# EAGLE design Temporary Solution v2 (EAGLE 9.6.2)
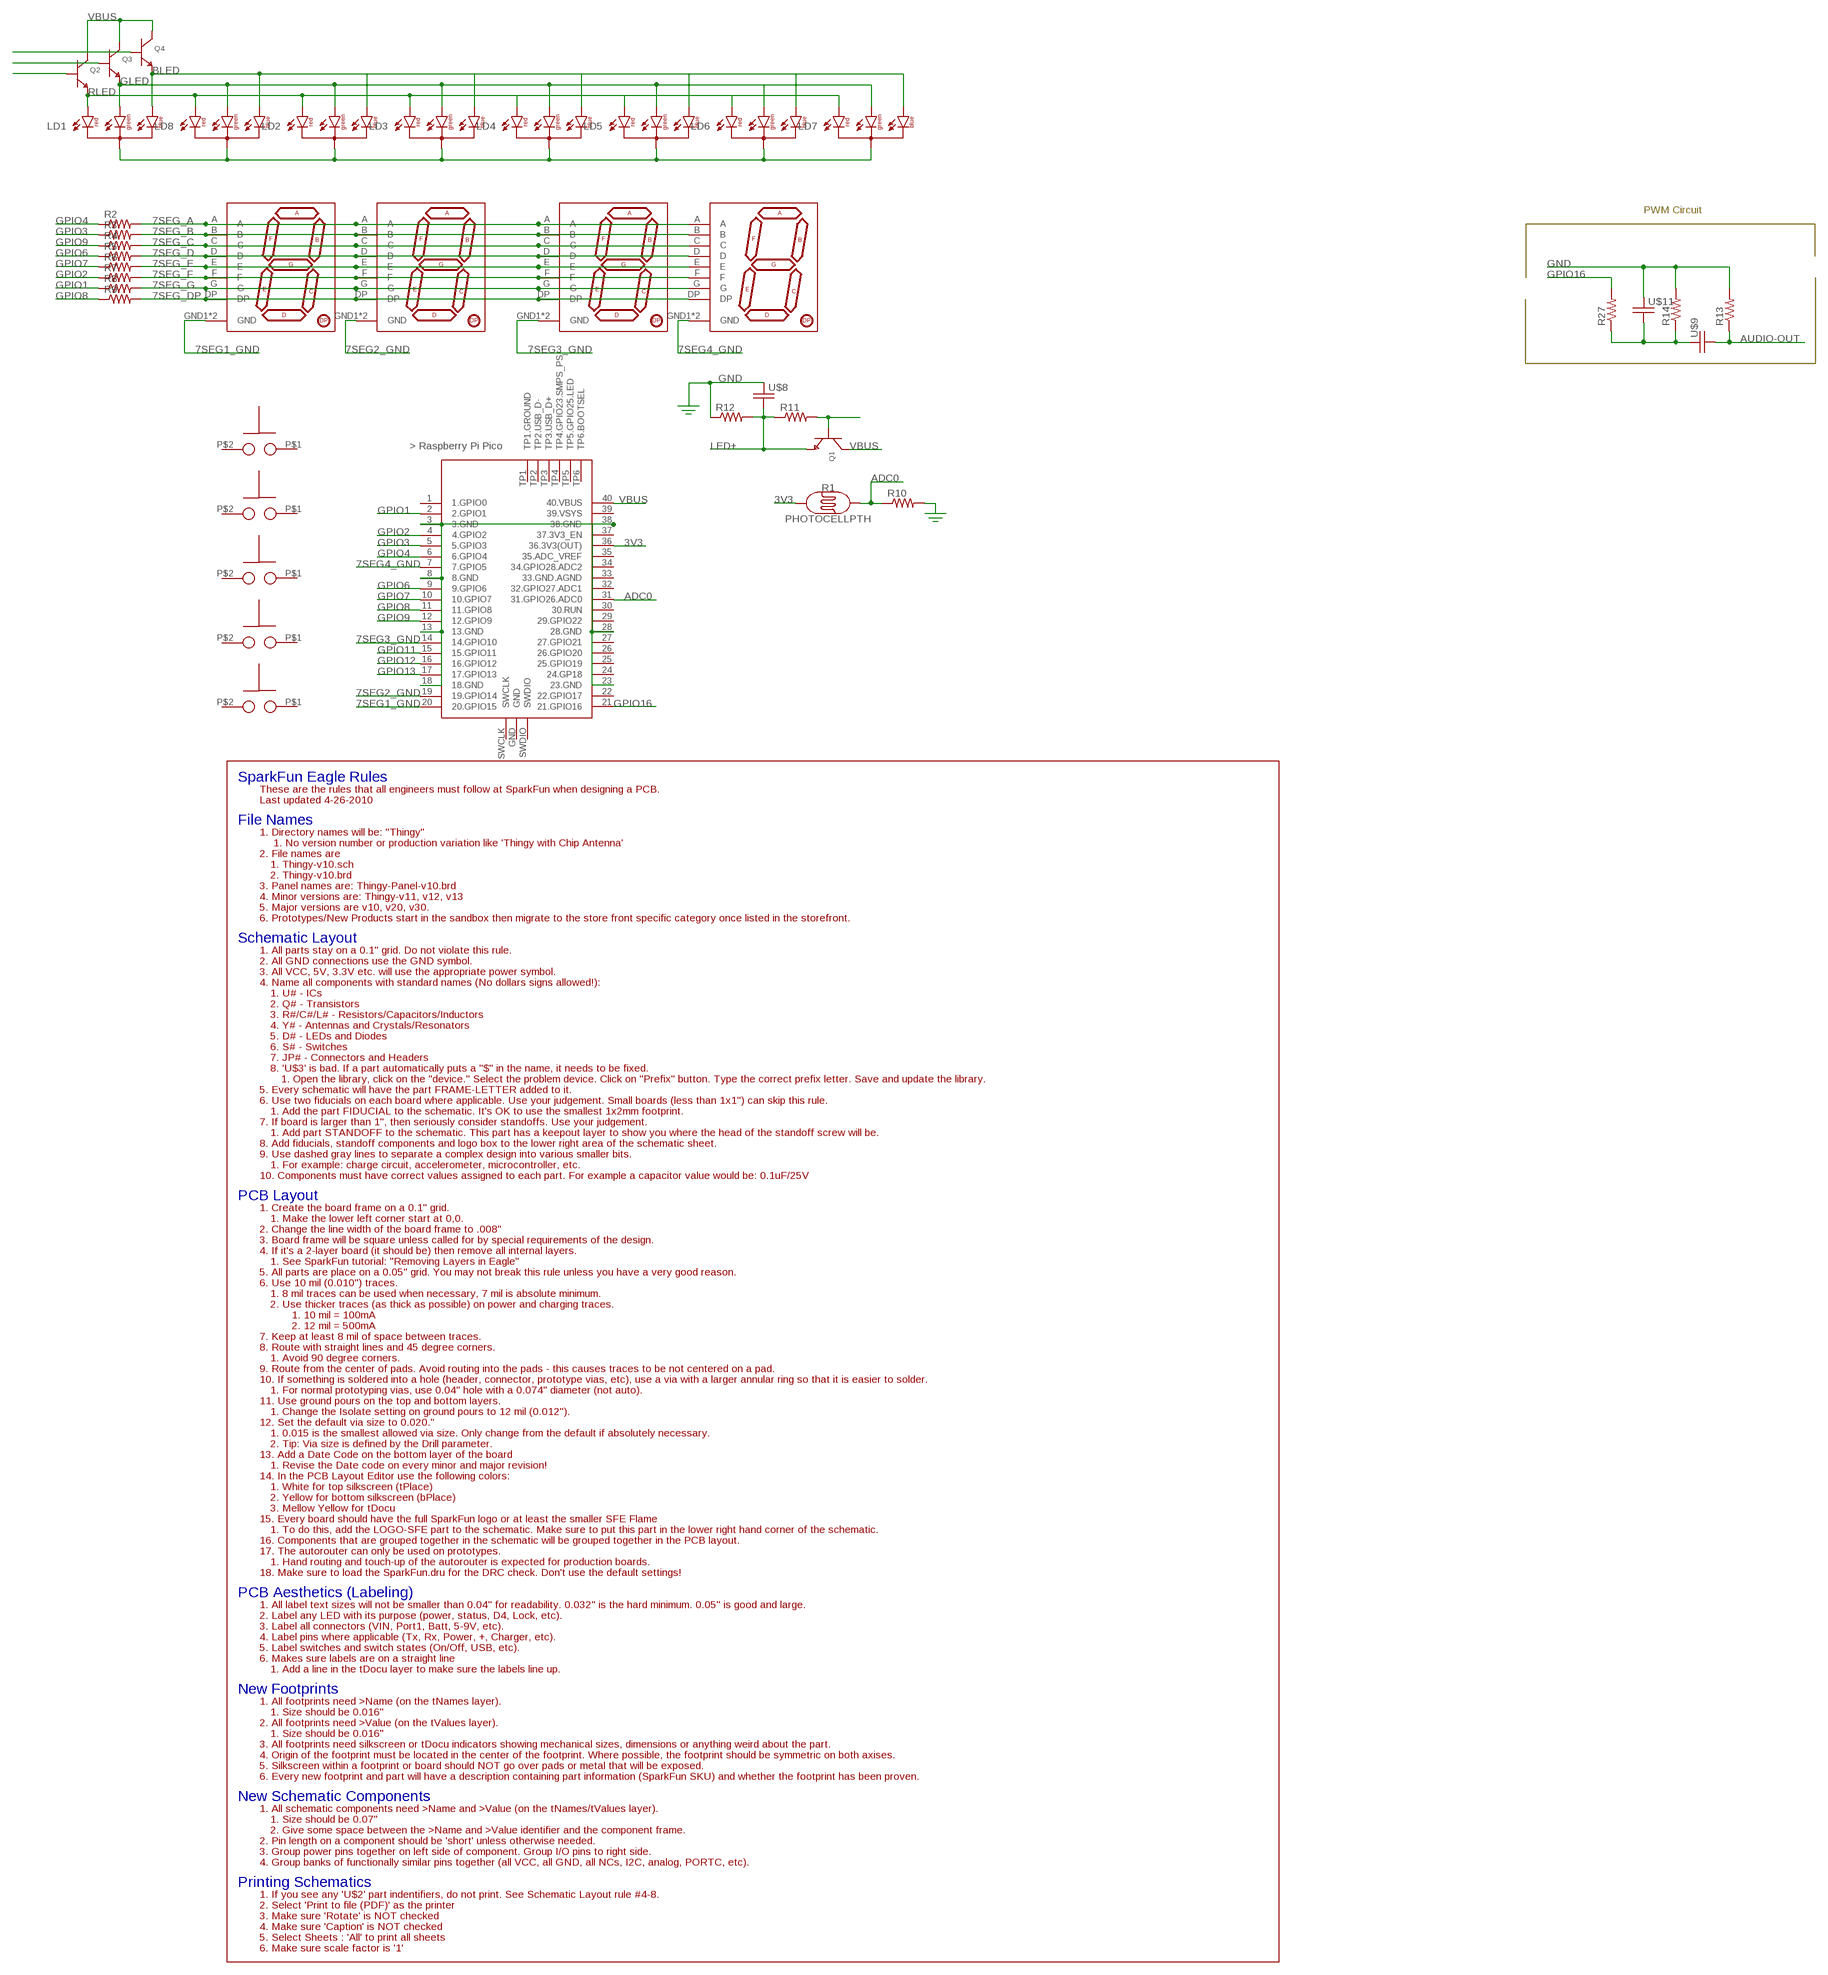
[diagram p0: schematic, sheet 1]

## Parts
D1  7SEGMENT-1DIGIT  [7SEGMENT-1DIGIT]
D2  7SEGMENT-1DIGIT  [7SEGMENT-1DIGIT]
D3  7SEGMENT-1DIGIT  [7SEGMENT-1DIGIT]
D4  7SEGMENT-1DIGIT  [7SEGMENT-1DIGIT]
LD1  LED_RGB  [LED_RGB]
LD2  LED_RGB  [LED_RGB]
LD3  LED_RGB  [LED_RGB]
LD4  LED_RGB  [LED_RGB]
LD5  LED_RGB  [LED_RGB]
LD6  LED_RGB  [LED_RGB]
LD7  LED_RGB  [LED_RGB]
LD8  LED_RGB  [LED_RGB]
Q1  BJT_NPN_EBC_2N2222  [NPN_EBC_.1IN]
Q2  BJT_NPN_EBC_2N2222  [NPN_EBC_.1IN]
Q3  BJT_NPN_EBC_2N2222  [NPN_EBC_.1IN]
Q4  BJT_NPN_EBC_2N2222  [NPN_EBC_.1IN]
R1  PHOTOCELLPTH  [PHOTOCELL]
R2  R-US_0207/7  [0207/7]
R3  R-US_0207/7  [0207/7]
R4  R-US_0207/7  [0207/7]
R5  R-US_0207/7  [0207/7]
R6  R-US_0207/7  [0207/7]
R7  R-US_0207/7  [0207/7]
R8  R-US_0207/7  [0207/7]
R9  R-US_0207/7  [0207/7]
R10  R-US_0207/7  [0207/7]
R11  R-US_0207/7  [0207/7]
R12  R-US_0207/7  [0207/7]
R13  R-US_0207/7  [0207/7]
R14  R-US_0207/7  [0207/7]
R27  R-US_0207/7  [0207/7]
U$2  RASPBERRY_PI_PICO_TH  [RASPBERRY_PI_PICO_TH]
U$3  BUTTONPUSHBUTTON_2-PIN  [BUTTON_PUSHBUTTON_2-PIN]
U$4  BUTTONPUSHBUTTON_2-PIN  [BUTTON_PUSHBUTTON_2-PIN]
U$5  BUTTONPUSHBUTTON_2-PIN  [BUTTON_PUSHBUTTON_2-PIN]
U$6  BUTTONPUSHBUTTON_2-PIN  [BUTTON_PUSHBUTTON_2-PIN]
U$7  BUTTONPUSHBUTTON_2-PIN  [BUTTON_PUSHBUTTON_2-PIN]
U$8  CAPACITOR-NONPOLARIZEDTH-CERAMIC  [CAPACITOR-CERAMIC]
U$9  CAPACITOR-NONPOLARIZEDTH-CERAMIC  [CAPACITOR-CERAMIC]
U$11  CAPACITOR-NONPOLARIZEDTH-CERAMIC  [CAPACITOR-CERAMIC]

## Nets
3V3: R1.1 U$2.36(36.3V3(OUT))
7SEG1_GND: D1.GND1(GND) D1.GND2(GND) U$2.20(20.GPIO15)
7SEG2_GND: D2.GND1(GND) D2.GND2(GND) U$2.19(19.GPIO14)
7SEG3_GND: D3.GND1(GND) D3.GND2(GND) U$2.14(14.GPIO10)
7SEG4_GND: D4.GND1(GND) D4.GND2(GND) U$2.7(7.GPIO5)
7SEG_A: D1.A D2.A D3.A D4.A R2.2
7SEG_B: D1.B D2.B D3.B D4.B R3.2
7SEG_C: D1.C D2.C D3.C D4.C R4.2
7SEG_D: D1.D D2.D D3.D D4.D R5.2
7SEG_DP: D1.DP D2.DP D3.DP D4.DP R9.2
7SEG_E: D1.E D2.E D3.E D4.E R6.2
7SEG_F: D1.F D2.F D3.F D4.F R7.2
7SEG_G: D1.G D2.G D3.G D4.G R8.2
ADC0: R1.2 R10.1 U$2.31(31.GPIO26.ADC0)
AUDIO-OUT: R13.1 U$9.2
BLED: LD1.BLUE LD2.BLUE LD3.BLUE LD4.BLUE LD5.BLUE LD6.BLUE LD7.BLUE LD8.BLUE Q4.3(E)
GLED: LD1.GRN(GREEN) LD2.GRN(GREEN) LD3.GRN(GREEN) LD4.GRN(GREEN) LD5.GRN(GREEN) LD6.GRN(GREEN) LD7.GRN(GREEN) LD8.GRN(GREEN) Q3.3(E)
GND: R10.2 R12.1 R13.2 R14.2 U$2.3(3.GND) U$2.8(8.GND) U$2.13(13.GND) U$2.18(18.GND) U$2.23(23.GND) U$2.28(28.GND) U$2.38(38.GND) U$8.1 U$11.1
GPIO1: R8.1 U$2.2(2.GPIO1)
GPIO2: R7.1 U$2.4(4.GPIO2)
GPIO3: R3.1 U$2.5(5.GPIO3)
GPIO4: R2.1 U$2.6(6.GPIO4)
GPIO6: R5.1 U$2.9(9.GPIO6)
GPIO7: R6.1 U$2.10(10.GPIO7)
GPIO8: R9.1 U$2.11(11.GPIO8)
GPIO9: R4.1 U$2.12(12.GPIO9)
GPIO11: U$2.15(15.GPIO11)
GPIO12: U$2.16(16.GPIO12)
GPIO13: U$2.17(17.GPIO13)
GPIO16: R27.2 U$2.21(21.GPIO16)
LED+: Q1.3(E) R11.1 R12.2 U$8.2
N$1: Q1.1(B) R11.2
N$10: LD1.GND LD2.GND LD3.GND LD4.GND LD5.GND LD6.GND LD7.GND LD8.GND
N$12: Q2.1(B)
N$13: Q3.1(B)
N$15: Q4.1(B)
N$76: R14.1 R27.1 U$9.1 U$11.2
RLED: LD1.RED LD2.RED LD3.RED LD4.RED LD5.RED LD6.RED LD7.RED LD8.RED Q2.3(E)
VBUS: Q1.2(C) Q2.2(C) Q3.2(C) Q4.2(C) U$2.40(40.VBUS)
Unconnected: U$2.1(1.GPIO0) U$2.22(22.GPIO17) U$2.24(24.GP18) U$2.25(25.GPIO19) U$2.26(26.GPIO20) U$2.27(27.GPIO21) U$2.29(29.GPIO22) U$2.30(30.RUN) U$2.32(32.GPIO27.ADC1) U$2.33(33.GND.AGND) U$2.34(34.GPIO28.ADC2) U$2.35(35.ADC_VREF) U$2.37(37.3V3_EN) U$2.39(39.VSYS) U$2.GND U$2.SWCLK U$2.SWDIO U$2.TP1(TP1.GROUND) U$2.TP2(TP2.USB_D-) U$2.TP3(TP3.USB_D+) U$2.TP4(TP4.GPIO23.SMPS_PS) U$2.TP5(TP5.GPIO25.LED) U$2.TP6(TP6.BOOTSEL) U$3.P$1 U$3.P$2 U$4.P$1 U$4.P$2 U$5.P$1 U$5.P$2 U$6.P$1 U$6.P$2 U$7.P$1 U$7.P$2

## Notes on the sheet
- PWM Circuit

## Library data of the parts
D1-D4 = Inventory:7SEGMENT-1DIGIT: 7-segment DISPLAY single cathode, 13 mm
LD1-LD8 = Inventory:LED_RGB: DUO LED 2 colors (red/yellow), 5 mm, round, common Cathode www.ligitek.com or other producers.
Q1-Q4 = Inventory:BJT_NPN_EBC_2N2222: NPN Transistor EBC .1 in spacing
R1 = SparkFun-Sensors:PHOTOCELL: Photocell (Photodetector, Photo Resistor, CdS) This is a very small light sensor. A photocell changes (also called a photodetector, photo resistor, CdS or photoconductive cell) resistance depending on the amount of light it is exposed to. These little sensors make great ambient light triggers (when light in the room turns on, do something). Datasheet <http://cdn.sparkfun.com/datasheets/Sensors/LightImaging/SEN-09088.pdf> SparkFun Products Mini Photocell <https://www.sparkfun.com/products/9088> (SEN-09088); PROD_ID: COMP-09129; SF_ID: SEN-09088
R2-R14 R27 = Inventory:R-US_: RESISTOR, American symbol; SPICEPREFIX: R
U$2 = Inventory:RASPBERRY_PI_PICO_TH: Raspberry Pi Pico microcontroller board for through-hole mounting. Originally made by codemicro (GitHub username), edited by Captain-Pumpkinhead (GitHub, Captain_Pumpkinhead for Reddit) to add the Test Points, and slightly adjust the proportions.
U$3-U$7 = Inventory:BUTTON
U$8 U$9 U$11 = Inventory:CAPACITOR-NONPOLARIZED

## Board
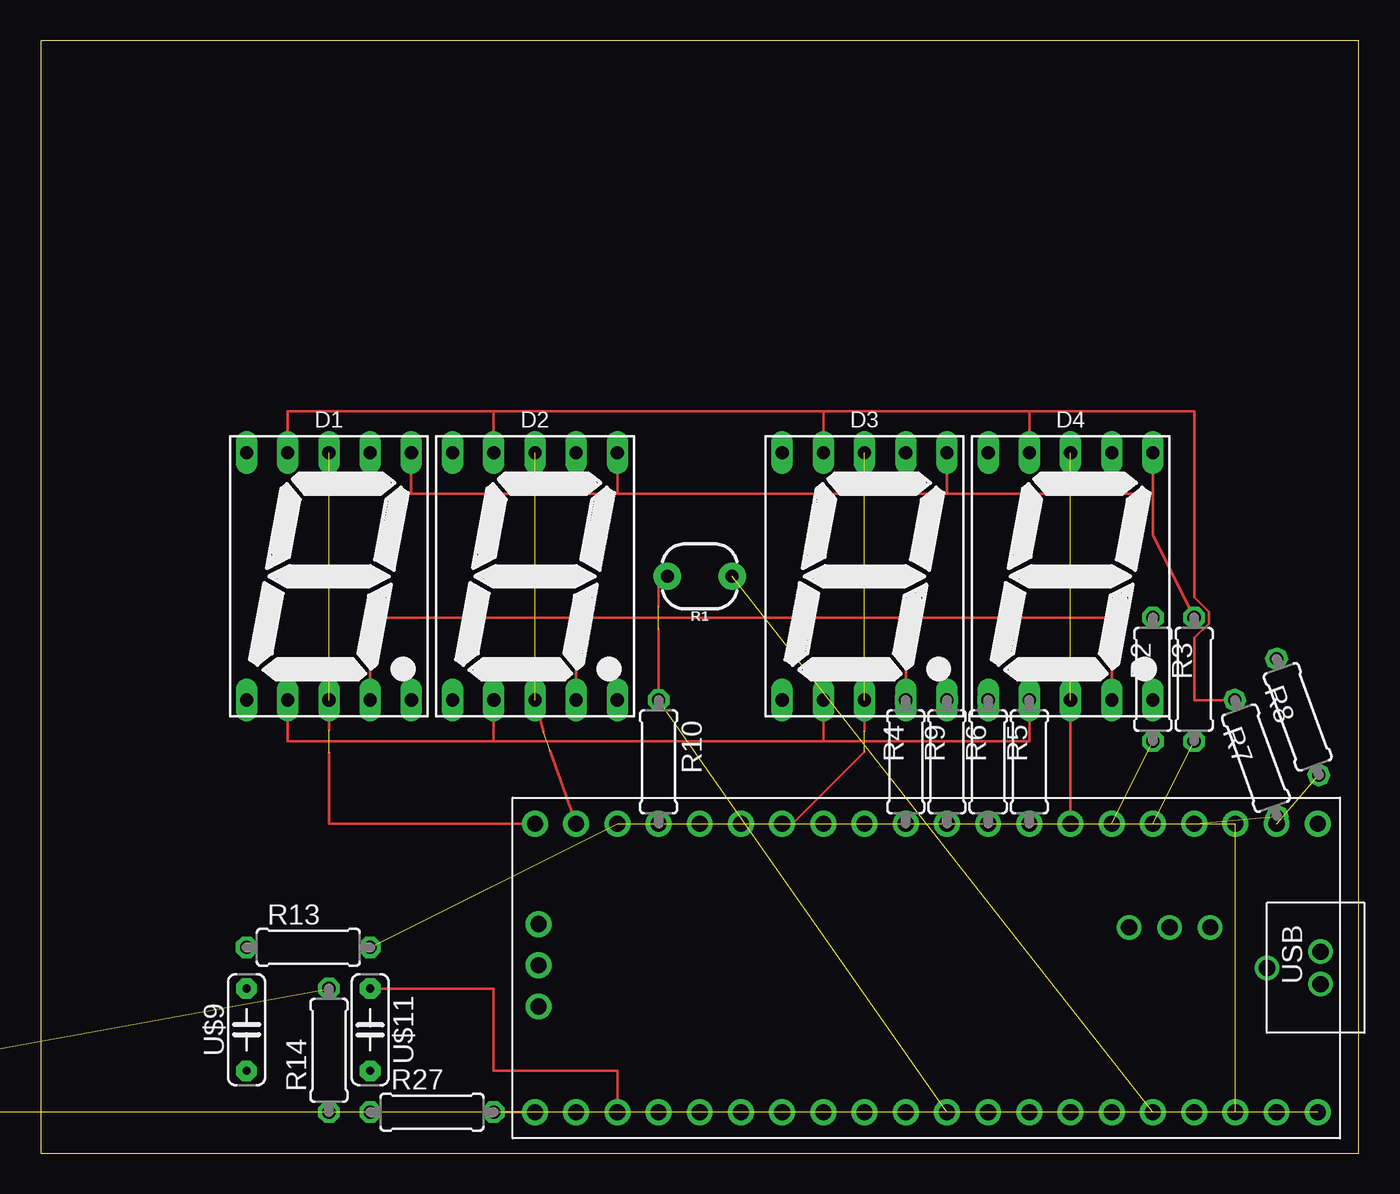
[diagram p1: board, top side]
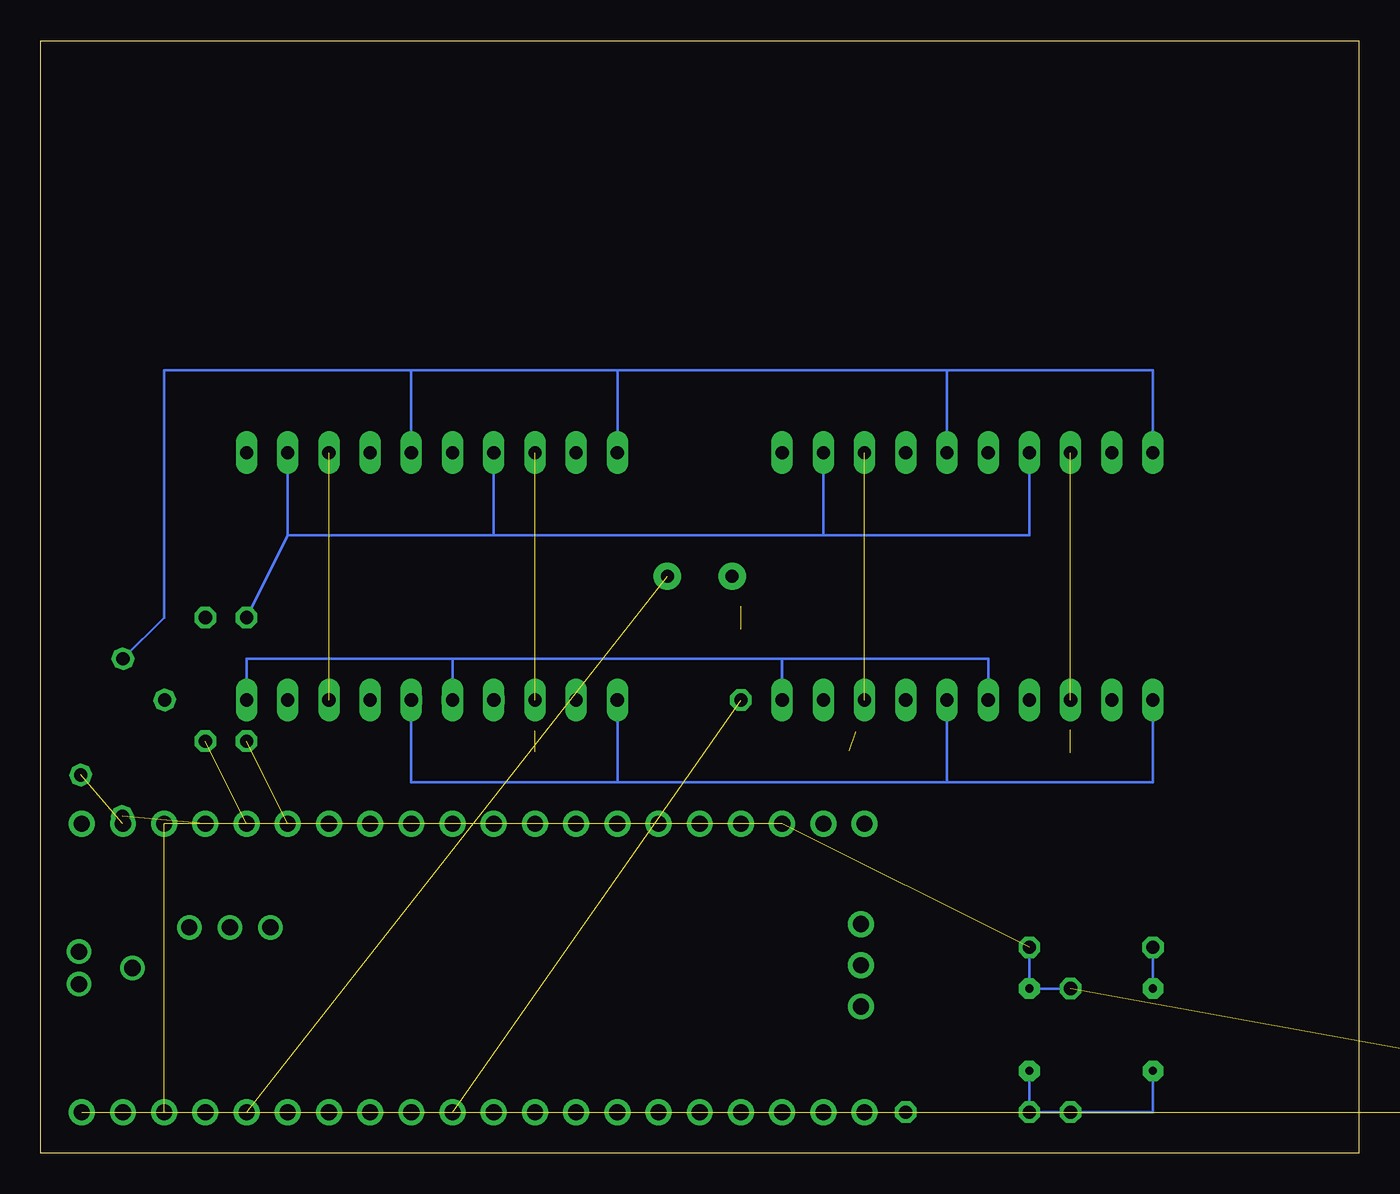
[diagram p2: board, bottom side, seen from below]

Size 81.28 x 68.58 mm. Coordinates in mm from the lower left corner, seen from the top.
Outline: 0,0 81.28,0 81.28,68.58 0,68.58 0,0
Copper layers (1*16): Top 0.035mm / dielectric 1.5mm / Bottom 0.035mm
Design rules "default": minimum track width 6mil, minimum drill 0.35mm, track to track 6mil, track to pad 6mil, pad to pad 6mil, via to via 6mil, smd to smd 6mil, copper to edge 40mil, drill to drill 6mil, minimum pad ring 10mil, minimum via ring 8mil, stop-mask expansion 4mil, vias tented up to drill 0mil, thermal gap 10mil

### Footprints (pad centres in the part's own frame; a part is rotated, then mirrored left to right if it is on the bottom)
7SEGMENT-1DIGIT = drill 0.813 long: A 2.54,7.62; B 5.08,7.62; C 2.54,-7.62; D -2.54,-7.62; DP 5.08,-7.62; E -5.08,-7.62; F -2.54,7.62; G -5.08,7.62; GND1 0,7.62; GND2 0,-7.62
LED_RGB = drill 0.5 long: BLUE 2.54,0; GND -0.847,0; GRN 0.847,0; RED -2.54,0
NPN_EBC_.1IN = drill 0.559 pad 1.905: 1 0,0; 2 0,2.54; 3 0,-2.54
PHOTOCELL = drill 0.8 pad 1.676: 1 -2,0; 2 2,0
0207/7 = drill 0.813 octagon: 1 -3.81,0; 2 3.81,0
RASPBERRY_PI_PICO_TH = drill 1 pad 1.6: 1 -8.89,24.13; 2 -8.89,21.59; 3 -8.89,19.05; 4 -8.89,16.51; 5 -8.89,13.97; 6 -8.89,11.43; 7 -8.89,8.89; 8 -8.89,6.35; 9 -8.89,3.81; 10 -8.89,1.27; 11 -8.89,-1.27; 12 -8.89,-3.81; 13 -8.89,-6.35; 14 -8.89,-8.89; 15 -8.89,-11.43; 16 -8.89,-13.97; 17 -8.89,-16.51; 18 -8.89,-19.05; 19 -8.89,-21.59; 20 -8.89,-24.13; 21 8.89,-24.13; 22 8.89,-21.59; 23 8.89,-19.05; 24 8.89,-16.51; 25 8.89,-13.97; 26 8.89,-11.43; 27 8.89,-8.89; 28 8.89,-6.35; 29 8.89,-3.81; 30 8.89,-1.27; 31 8.89,1.27; 32 8.89,3.81; 33 8.89,6.35; 34 8.89,8.89; 35 8.89,11.43; 36 8.89,13.97; 37 8.89,16.51; 38 8.89,19.05; 39 8.89,21.59; 40 8.89,24.13; GND -0.16,-23.9; SWCLK -2.7,-23.9; SWDIO 2.38,-23.9 | drill 1 pad 1.5: TP1 0,21; TP2 1,24.3; TP3 -1,24.3; TP4 -2.5,17.5; TP5 -2.5,15; TP6 -2.5,12.5
BUTTON_PUSHBUTTON_2-PIN = drill 0.55 octagon: P$1 -2.54,0; P$2 2.54,0
CAPACITOR-CERAMIC = drill 0.5 pad 1.27 octagon: 1 -2.54,0; 2 2.54,0

### Placement (x,y rotation side)
D1  17.78,35.56 0 top
D2  30.48,35.56 0 top
D3  50.8,35.56 0 top
D4  63.5,35.56 0 top
LD1  -45.72,-15.24 0 top  (outside the outline)
LD2  -45.72,-22.86 0 top  (outside the outline)
LD3  -45.72,-30.48 0 top  (outside the outline)
LD4  -45.72,-38.1 0 top  (outside the outline)
LD5  -45.72,-45.72 0 top  (outside the outline)
LD6  -45.72,-53.34 0 top  (outside the outline)
LD7  -45.72,-60.96 0 top  (outside the outline)
LD8  -45.72,-68.58 0 top  (outside the outline)
Q1  -48.26,5.08 180 top  (outside the outline)
Q2  -38.1,-76.2 0 top  (outside the outline)
Q3  -38.1,-83.82 0 top  (outside the outline)
Q4  -38.1,-91.44 0 top  (outside the outline)
R1  40.64,35.56 180 top
R2  68.58,29.21 90 top
R3  71.12,29.21 90 top
R4  53.34,24.13 90 top
R5  60.96,24.13 90 top
R6  58.42,24.13 90 top
R7  74.93,24.36 110 top
R8  77.5,26.9 110 top
R9  55.88,24.13 90 top
R10  38.1,24.13 270 top
R11  -43.18,12.7 180 top  (outside the outline)
R12  -43.18,17.78 180 top  (outside the outline)
R13  16.51,12.7 0 top
R14  17.78,6.35 90 top
R27  24.13,2.54 0 top
U$2  54.61,11.43 270 top
U$3  7.62,-7.62 0 top  (outside the outline)
U$4  78.74,-7.62 0 top  (outside the outline)
U$5  60.96,-7.62 0 top  (outside the outline)
U$6  22.86,-7.62 0 top  (outside the outline)
U$7  40.64,-7.62 0 top  (outside the outline)
U$8  -40.64,0 180 top  (outside the outline)
U$9  12.7,7.62 90 top
U$11  20.32,7.62 270 top

### Tracks (layer width: path | path; a pad name or v marks a point on that pad's centre or on a via)
3V3  (1 unrouted)
7SEG1_GND  (2 unrouted)
  Top 0.152: U$2.20 17.78,20.32 17.78,24.69 | D1.GND2 17.78,26.11
7SEG2_GND  (2 unrouted)
  Top 0.152: D2.GND2 31.02,25.99 | 31.43,24.81 U$2.19
7SEG3_GND  (2 unrouted)
  Top 0.152: D3.GND2 50.8,26.04 | 50.8,24.77 46.35,20.32 U$2.14
7SEG4_GND  (1 unrouted)
  Top 0.152: D4.GND2 U$2.7
7SEG_A
  Bottom 0.152: 33.02,38.1 53.34,38.1 | 53.34,38.1 66.04,38.1 | D1.A 20.32,38.1 33.02,38.1 | D4.A 66.04,38.1 | D3.A 53.34,38.1 | D2.A 33.02,38.1 | 66.04,38.1 R2.2
7SEG_B
  Top 0.152: D1.B 22.86,40.64 35.56,40.64 | D4.B 68.58,40.64 | 35.56,40.64 55.88,40.64 | 55.88,40.64 68.58,40.64 | D3.B 55.88,40.64 | D2.B 35.56,40.64 | 68.58,40.64 68.58,38.1 R3.2
7SEG_C
  Top 0.152: D1.C 20.32,33.02 33.02,33.02 | 53.34,33.02 43.18,33.02 33.02,33.02 | 53.34,33.02 66.04,33.02 D4.C | R4.2 53.34,33.02 | 33.02,33.02 D2.C
7SEG_D
  Top 0.152: 27.94,25.4 15.24,25.4 D1.D 15.24,26.11 | 27.94,25.4 48.26,25.4 | 48.26,25.4 60.96,25.4 R5.2 | D2.D 27.94,25.4 | 48.26,25.4 D3.D
7SEG_DP
  Bottom 0.152: 55.88,30.48 35.56,30.48 | 55.88,30.48 68.58,30.48 D4.DP | D1.DP 22.86,30.48 35.56,30.48 | R9.2 55.88,30.48 | 35.56,30.48 D2.DP
7SEG_E
  Bottom 0.152: D1.E 12.7,22.86 25.4,22.86 | 25.4,22.86 45.72,22.86 | R6.2 58.42,22.86 48.26,22.86 45.72,22.86 | D2.E 25.4,22.86 | 45.72,22.86 D3.E
7SEG_F
  Top 0.152: D1.F 15.24,45.72 27.94,45.72 | 27.94,45.72 48.26,45.72 | 48.26,45.72 60.96,45.72 | 60.96,45.72 D4.F | D3.F 48.26,45.72 | D2.F 27.94,45.72 | 60.96,45.72 71.12,45.72 71.12,34.28 72.01,33.39 72.01,32.65 71.12,31.76 71.12,27.94 R7.2
7SEG_G
  Bottom 0.152: D1.G 12.7,48.26 25.4,48.26 | 25.4,48.26 45.72,48.26 | 45.72,48.26 58.42,48.26 | 58.42,48.26 D4.G | D3.G 45.72,48.26 | D2.G 25.4,48.26 | 58.42,48.26 73.66,48.26 73.66,33.02 R8.2
ADC0  (2 unrouted)
  Top 0.152: R1.2 38.1,35.56 38.1,33.73 | 38.1,32.31 R10.1
AUDIO-OUT
  Bottom 0.152: U$9.2 R13.1
BLED  (8 unrouted)
GLED  (8 unrouted)
GND  (9 unrouted)
  Top 0.152: U$11.1 27.94,10.16 27.94,5.08 35.56,5.08 U$2.23
  Bottom 0.152: R13.2 U$11.1 R14.2
GPIO1  (1 unrouted)
GPIO2  (1 unrouted)
GPIO3  (1 unrouted)
GPIO4  (1 unrouted)
GPIO6  (1 unrouted)
GPIO7  (1 unrouted)
GPIO8  (1 unrouted)
GPIO9  (1 unrouted)
GPIO16
  Top 0.152: R27.2 U$2.21
LED+  (3 unrouted)
N$1  (1 unrouted)
N$10  (7 unrouted)
N$76
  Bottom 0.152: U$11.2 R27.1 R14.1 12.7,2.54 U$9.1
RLED  (8 unrouted)
VBUS  (4 unrouted)